# EAGLE design LEDResetBoardRevB (EAGLE 7.5.0)
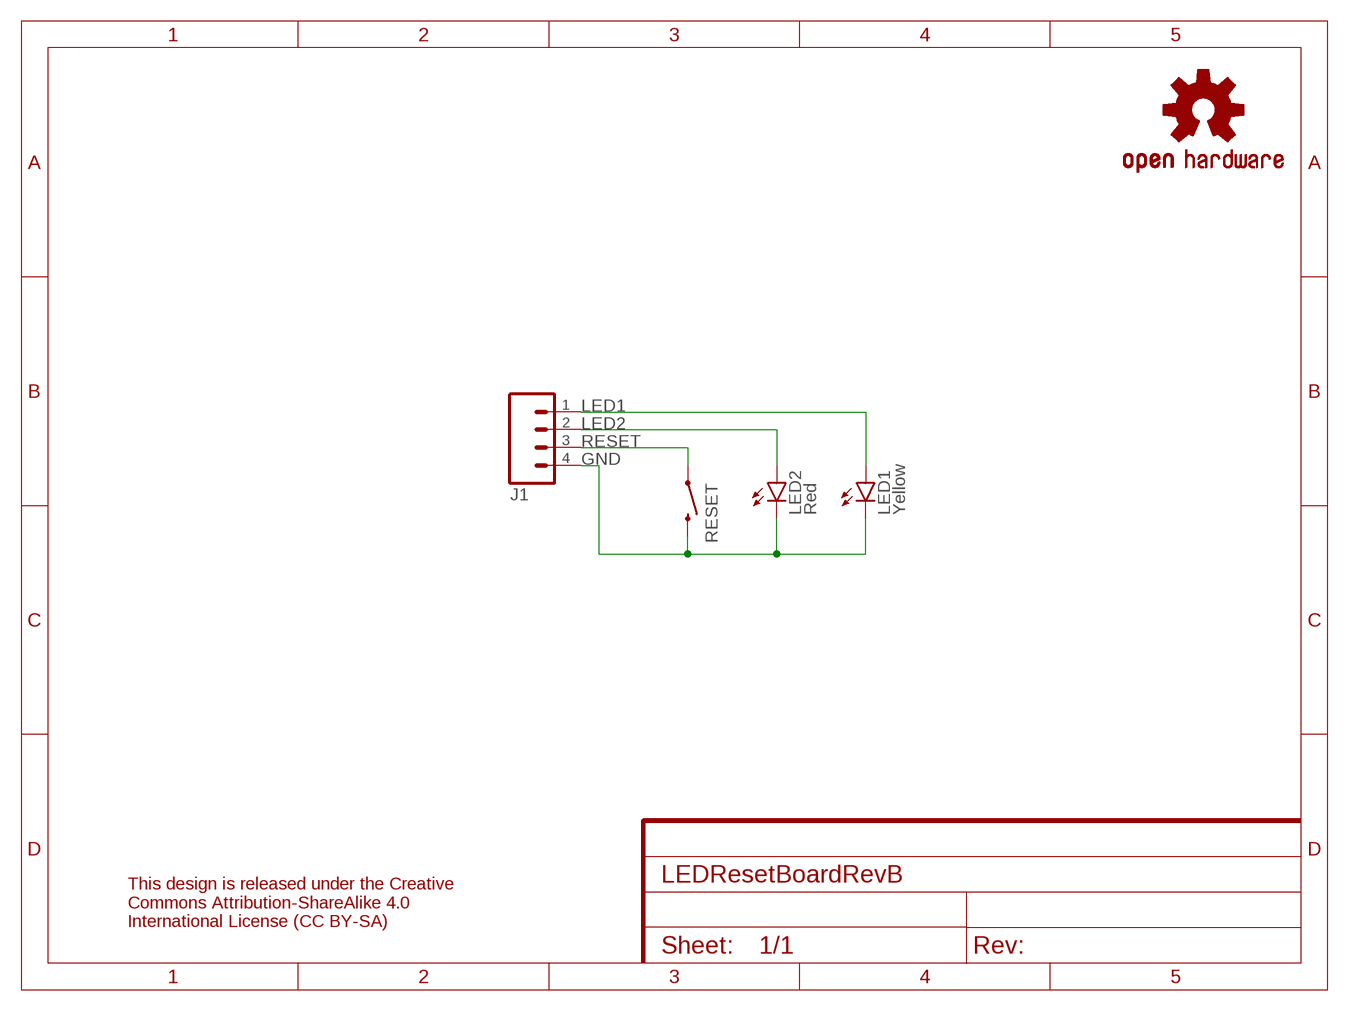
[diagram p0: schematic, sheet 1]
FRAME1 (FRAME-A5L): CNAME: Simulator LED/Reset Switch Board; CREVISION: B 08/2016; DESIGNER: Andrew Instone-Cowie

## Parts
J1  M04PTH  [1X04]
LED1  Yellow  LED3MM  [LED3MM]
LED2  Red  LED3MM  [LED3MM]
LOGO1  OSHW-LOGOS  [OSHW-LOGO-S]
RESET  SWITCH-MOMENTARY-2PTH  [TACTILE-PTH]

## Nets
GND: J1.4 LED1.K(C) LED2.K(C) RESET.3
LED1: J1.1 LED1.A
LED2: J1.2 LED2.A
RESET: J1.3 RESET.1

## Notes on the sheet
- This design is released under the Creative
  Commons Attribution-ShareAlike 4.0
  International License (CC BY-SA)

## Library data of the parts
J1 = SparkFun-Connectors:M04: Header 4 Standard 4-pin 0.1" header. Use with straight break away headers (SKU : PRT-00116), right angle break away headers (PRT-00553), swiss pins (PRT-00743), machine pins (PRT-00117), and female headers (PRT-00115). Molex polarized connector foot print use with SKU : PRT-08231 with associated crimp pins and housings. 1MM SMD Version SKU: PRT-10208
LED1 LED2 = SparkFun-LED:LED: LEDs Standard schematic elements and footprints for 5mm, 3mm, 1206, and 0603 sized LEDs. 5mm - Spark Fun Electronics SKU : COM-00529 (and others)
LOGO1 = SparkFun-Aesthetics:OSHW-LOGO: Open Source Hardware Logo This logo indicates the piece of hardware it is found on incorporates a OSHW license and/or adheres to the definition of open source hardware found here: http://freedomdefined.org/OSHW
RESET = SparkFun-Electromechanical:SWITCH-MOMENTARY-2: Various NO switches- pushbuttons, reed, etc

## Board
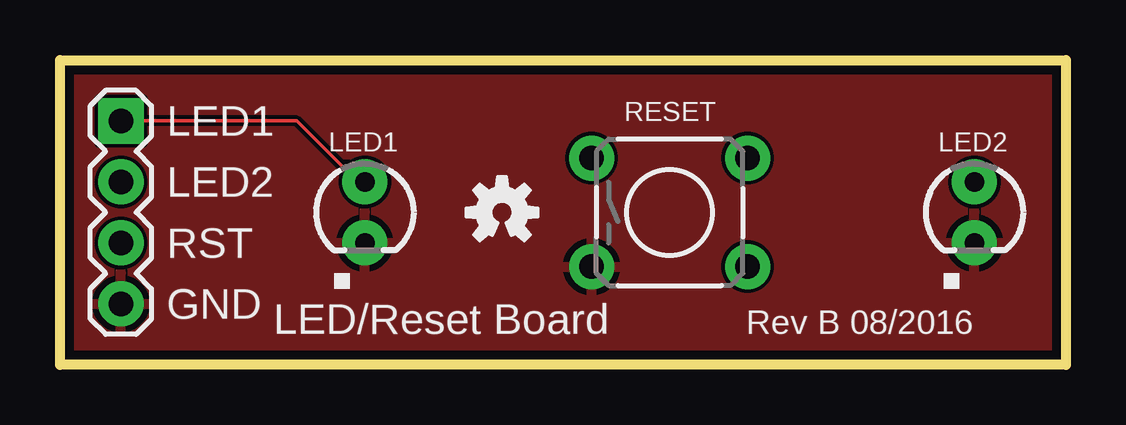
[diagram p1: board, top side]
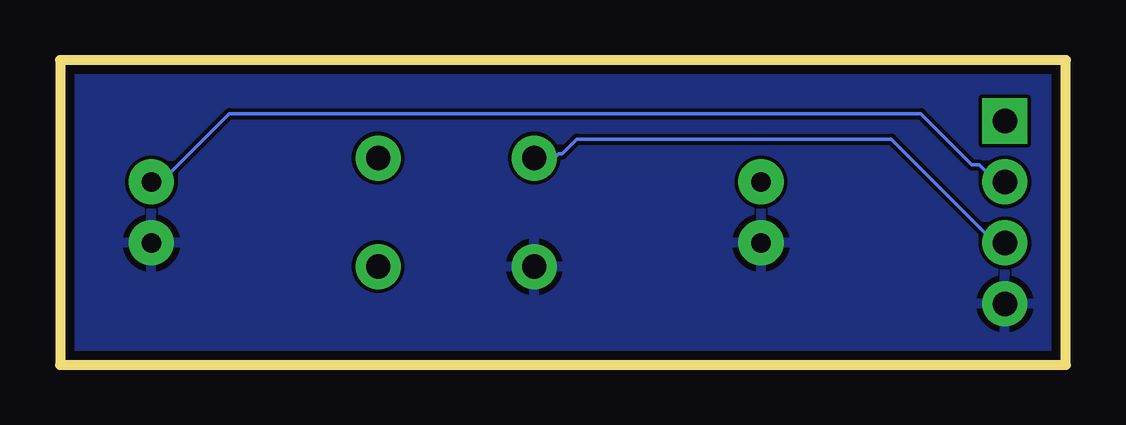
[diagram p2: board, bottom side, seen from below]

Size 41.91 x 12.7 mm. Coordinates in mm from the lower left corner, seen from the top.
Outline: 0,12.7 41.91,12.7 41.91,0 0,0 0,12.7
Copper layers (1*16): Top 0.0356mm / dielectric 1.5011mm / Bottom 0.0356mm
Design rules "LaenPCBOrder(OSHPARK)": minimum track width 6mil, minimum drill 13mil, track to track 6mil, track to pad 6mil, pad to pad 6mil, via to via 6mil, smd to smd 6mil, copper to edge 15mil, drill to drill 6mil, minimum pad ring 7mil, minimum via ring 7mil, stop-mask expansion 3mil, vias tented up to drill 0mil, thermal gap 10mil

### Footprints (pad centres in the part's own frame; a part is rotated, then mirrored left to right if it is on the bottom)
1X04 = drill 1.016 pad 1.88 square: 1 0,0 | drill 1.016 pad 1.88: 2 2.54,0; 3 5.08,0; 4 7.62,0
LED3MM = drill 0.813 pad 1.88: A -1.27,0; K 1.27,0
TACTILE-PTH = drill 1.016 pad 1.88: 1 -3.251,2.261; 2 3.251,2.261; 3 -3.251,-2.261; 4 3.251,-2.261

### Placement (x,y rotation side)
J1  2.54,10.16 270 top
LED1  12.7,6.35 270 top
LED2  38.1,6.35 270 top
LOGO1  18.41,6.35 0 top
RESET  25.4,6.35 0 top

### Tracks (layer width: path | path; a pad name or v marks a point on that pad's centre or on a via)
GND
  pour Bottom: 0,12.7 41.91,12.7 41.91,0 0,0
  pour Top: 0,12.7 41.91,12.7 41.91,0 0,0
LED1
  Top 0.152: J1.1 9.86,10.16 12.29,7.72 12.6,7.72 LED1.A
LED2
  Bottom 0.152: J1.2 2.54,7.72 3,7.72 3.61,8.33 3.91,8.33 6.04,10.46 34.85,10.46 37.59,7.72 38.05,7.72 LED2.A
RESET
  Bottom 0.152: J1.3 2.54,5.13 3,5.13 7.26,9.4 20.37,9.4 20.98,8.79 21.13,8.79 21.29,8.64 22.05,8.64 RESET.1

### Text on the board
tPlace: LED1 / LED2 / RST / GND | LED/Reset Board | Rev B 08/2016